# Altium schematic sheet ESP32_WROM_32.SchDoc
size A; SheetNumber: 2; SheetTotal: 7
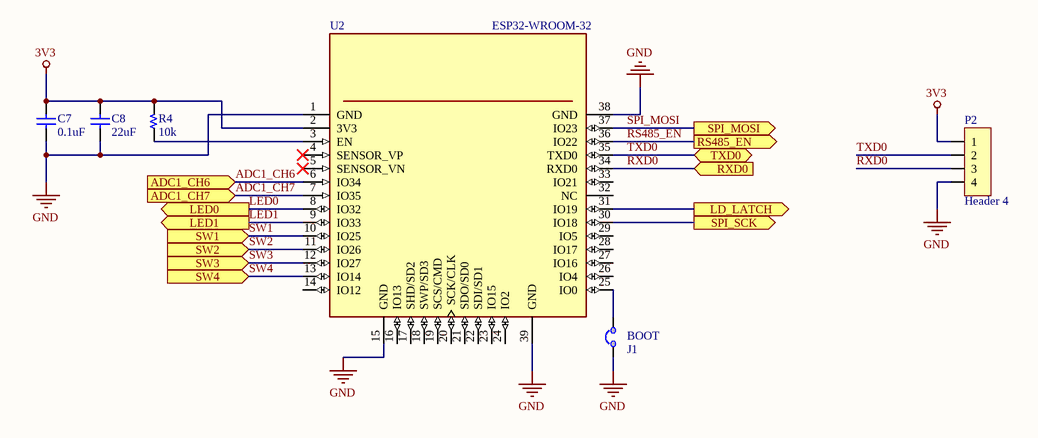
[diagram p0: ESP32_WROM_32.SchDoc]

## Parts
C7  0.1uF  [C 0805]
C8  22uF  [C 0805]
J1  BOOT  [JUMP/2/Close]  (no BOM)
P2  Header 4  [HDR/Header/4]
R4  10k  [R 0805]
U2  ESP32-WROOM-32  [MODULE_ESP32-WROOM-32]

## Ports
ADC1_CH6 (in, see Current_Sensor_Circuit[2A]), ADC1_CH7 (in, see Current_Sensor_Circuit[2A]), LD_LATCH (out, see IC_74HC595[1C]), LED0 (out, see High_Current_LEDs[1B]), LED1 (out, see High_Current_LEDs[2B]), RS485_EN (out, see RS_485[1B]), RXD0 (in, see RS_485[1B]), SPI_MOSI (out, see IC_74HC595[1C]), SPI_SCK (out, see IC_74HC595[1C]), SW1 (in, see Slide_Switch[3B]), SW2 (in, see Slide_Switch[3B]), SW3 (in, see Slide_Switch[3B]), SW4 (in, see Slide_Switch[3B]), TXD0 (bidir, see RS_485[1B])

## Nets
3V3: C7.1 C8.1 P2.1 R4.2 U2.2(3V3)
GND: C7.2 C8.2 J1.1 P2.4 U2.1(GND) U2.15(GND) U2.38(GND) U2.39(GND)
ADC1_CH6: U2.6(IO34) ; port ADC1_CH6
ADC1_CH7: U2.7(IO35) ; port ADC1_CH7
LD_LATCH: U2.31(IO19) ; port LD_LATCH
LED0: U2.8(IO32) ; port LED0
LED1: U2.9(IO33) ; port LED1
RS485_EN: U2.36(IO22) ; port RS485_EN
RXD0: P2.3 U2.34(RXD0) ; port RXD0
SPI_MOSI: U2.37(IO23) ; port SPI_MOSI
SPI_SCK: U2.30(IO18) ; port SPI_SCK
SW1: U2.10(IO25) ; port SW1
SW2: U2.11(IO26) ; port SW2
SW3: U2.12(IO27) ; port SW3
SW4: U2.13(IO14) ; port SW4
TXD0: P2.2 U2.35(TXD0) ; port TXD0
NetJ1_2: J1.2 U2.25(IO0)
NetR4_1: R4.1 U2.3(EN)

Not connected (* = marked no-connect by the designer): U2 4(SENSOR_VP)* 5(SENSOR_VN)* 14(IO12) 16(IO13) 17(SHD/SD2) 18(SWP/SD3) 19(SCS/CMD) 20(SCK/CLK) 21(SDO/SD0) 22(SDI/SD1) 23(IO15) 24(IO2) 26(IO4) 27(IO16) 28(IO17) 29(IO5) 32(NC) 33(IO21)

## Library data of the parts
C7 C8 = Capacitor NP: Capacitor non-pol
J1 = JUMP 2
P2 = Header 4: Header, 4-Pin
R4 = Resistor
U2 = ESP32-WROOM-32: Bluetooth, WiFi 802.11b/g/n, Bluetooth v4.2 + EDR, Class 1, 2 and 3 Transceiver Module 2.4GHz ~ 2.5GHz Integrated, Trace Surface Mount; MF: Espressif Systems; MP: ESP32-WROOM-32D; Price: None; Package: Module Espressif Systems; Availability: Unavailable; SnapEDA_Link: https://www.snapeda.com/parts/ESP32-WROOM-32D/Espressif%20Systems/view-part/2768115/?ref=snap; Value: *